# EAGLE design charger_max1811usb (EAGLE 5.11)
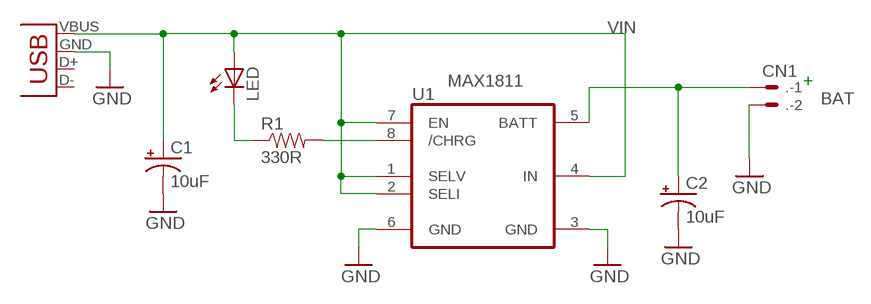
[diagram p0: schematic, sheet 1]

## Parts
.  CN1  22-23-2021  [22-23-2021]
C1  10uF  CAP_POL1206  [EIA3216]
C2  10uF  CAP_POL1206  [EIA3216]
LED  LED0603  [LED-0603]
R1  330R  RESISTOR0603  [0603]
U1  MAX1811  [SO08]
X1  USB-A-H  [USB-A-H]

## Nets
BAT: ..1 C2.A(+) U1.5(BATT)
GND: ..2 C1.C(-) C2.C(-) U1.3(GND) U1.6(GND) X1.GND(VBUS)
N$2: LED.C R1.1
N$3: R1.2 U1.8(/CHRG)
VIN: C1.A(+) LED.A U1.1(SELV) U1.2(SELI) U1.4(IN) U1.7(EN) X1.VBUS(GND)
Unconnected: X1.D+(D-) X1.D-(D+)

## Notes on the sheet
- +

## Library data of the parts
. = con-molex:22-23-2021: .100" (2.54mm) Center Header - 2 Pin; MF: MOLEX; MPN: 22-23-2021; OC_FARNELL: 1462926; OC_NEWARK: 25C3832
C1 C2 = SparkFunEagle-6-6-07:CAP_POL: Capacitor Polarized These are standard SMD and PTH capacitors. Normally 10uF, 47uF, and 100uF in electrolytic and tantalum varieties. Always verify the external diameter of the through hole cap, it varies with capacity, voltage, and manufacturer. The EIA devices should be standard.
LED = SparkFun:LED: LEDs Standard schematic elements and footprints for 5mm, 3mm, 1206, and 0603 sized LEDs. 5mm - Spark Fun Electronics SKU : COM-00529 (and others)
R1 = SparkFun:RESISTOR: Resistor Basic schematic elements and footprints for 0603, 1206, and PTH 1/10th watt (small) resistors.
U1 = max1811:MAX1811
X1 = SparkFun:USB: USB Connectors USB-B-PTH is fully proven SKU : PRT-00139 USB-miniB is fully proven SKU : PRT-00587 USB-A-PCB is untested. USB-A-H is throughly reviewed, but untested. Spark Fun Electronics SKU : PRT-00437 USB-B-SMT is throughly reviewed, but untested. Needs silkscreen touching up. USB-A-S has not been used/tested USB-MB-H has not been used/tested

## Board
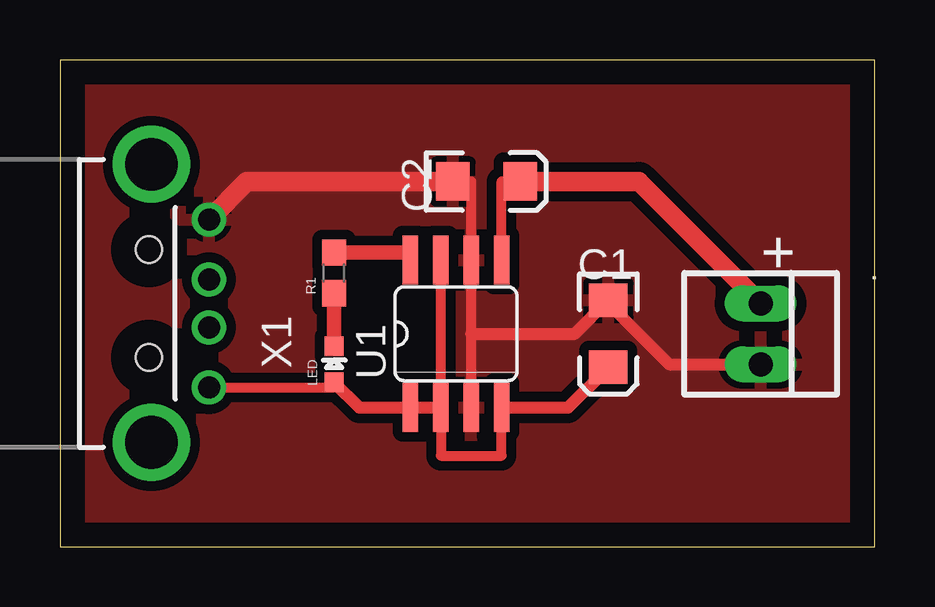
[diagram p1: board, top side]

Size 33.96 x 20.31 mm. Coordinates in mm from the lower left corner, seen from the top.
Outline: 0,0 33.96,0 33.96,20.31 0,20.31 0,0
Copper layers (1*16): Top 0.035mm / dielectric 1.5mm / Bottom 0.035mm
Design rules "default": minimum track width 10mil, minimum drill 24mil, track to track 8mil, track to pad 8mil, pad to pad 8mil, via to via 8mil, smd to smd 8mil, copper to edge 40mil, drill to drill 8mil, minimum pad ring 10mil, minimum via ring 8mil, stop-mask expansion 4mil, vias tented up to drill 0mil, thermal gap 10mil

### Footprints (pad centres in the part's own frame; a part is rotated, then mirrored left to right if it is on the bottom)
22-23-2021 = drill 1 long: 1 -1.27,0; 2 1.27,0
EIA3216 = smd 1.4 x 1.6: A 1.4,0; C -1.4,0
LED-0603 = smd 0.8 x 0.8: A 0,-0.75; C 0,0.75
0603 = smd 1.1 x 1: 1 -0.85,0; 2 0.85,0
SO08 = smd 0.66 x 2.032: 1 -1.905,-3.073; 2 -0.635,-3.073; 3 0.635,-3.073; 4 1.905,-3.073; 5 1.905,3.073; 6 0.635,3.073; 7 -0.635,3.073; 8 -1.905,3.073
USB-A-H = drill 0.914 round: D+ 2.4,1; D- 2.4,-1; GND 2.4,3.5; VBUS 2.4,-3.5 | drill 2.2 round: GND@1 0,5.8; GND@2 0,-5.8 | hole 1.1: -0.1,2.25; -0.1,-2.25

### Placement (x,y rotation side)
.  29.21,8.89 270 top
C1  22.86,8.89 270 top
C2  17.78,15.24 0 top
LED  11.43,7.62 0 top
R1  11.43,11.43 90 top
U1  16.51,8.89 0 top
X1  3.81,10.16 0 top

### Tracks (layer width: path | path; a pad name or v marks a point on that pad's centre or on a via)
BAT
  Top 0.406: C2.A 18.41,15.24 U1.5
  Top 0.813: ..1 24.13,15.24 C2.A
GND
  Top 0.406: U1.3 17.14,8.89 U1.6 17.14,15.24 C2.C
  Top 0.508: ..2 25.4,7.62 22.86,10.16 C1.C 21.46,8.89 17.14,8.89
  Top 0.813: X1.GND 7.79,15.24 C2.C
  pour Top (isolate 0.406): 0,20.32 33.02,20.32 33.02,0 0,0
N$2
  Top 0.61: LED.C R1.1
N$3
  Top 0.61: R1.2 14.6,12.28 U1.8
VIN
  Top 0.406: X1.VBUS 11.43,6.66 LED.A | U1.7 U1.2 15.88,3.81 18.41,3.81 U1.4
  Top 0.508: C1.A 21.19,5.82 U1.4 | LED.A 12.48,5.82 U1.1 U1.2

### Text on the board
tPlace: +